# Altium project BrushlessDriver.PrjPCB
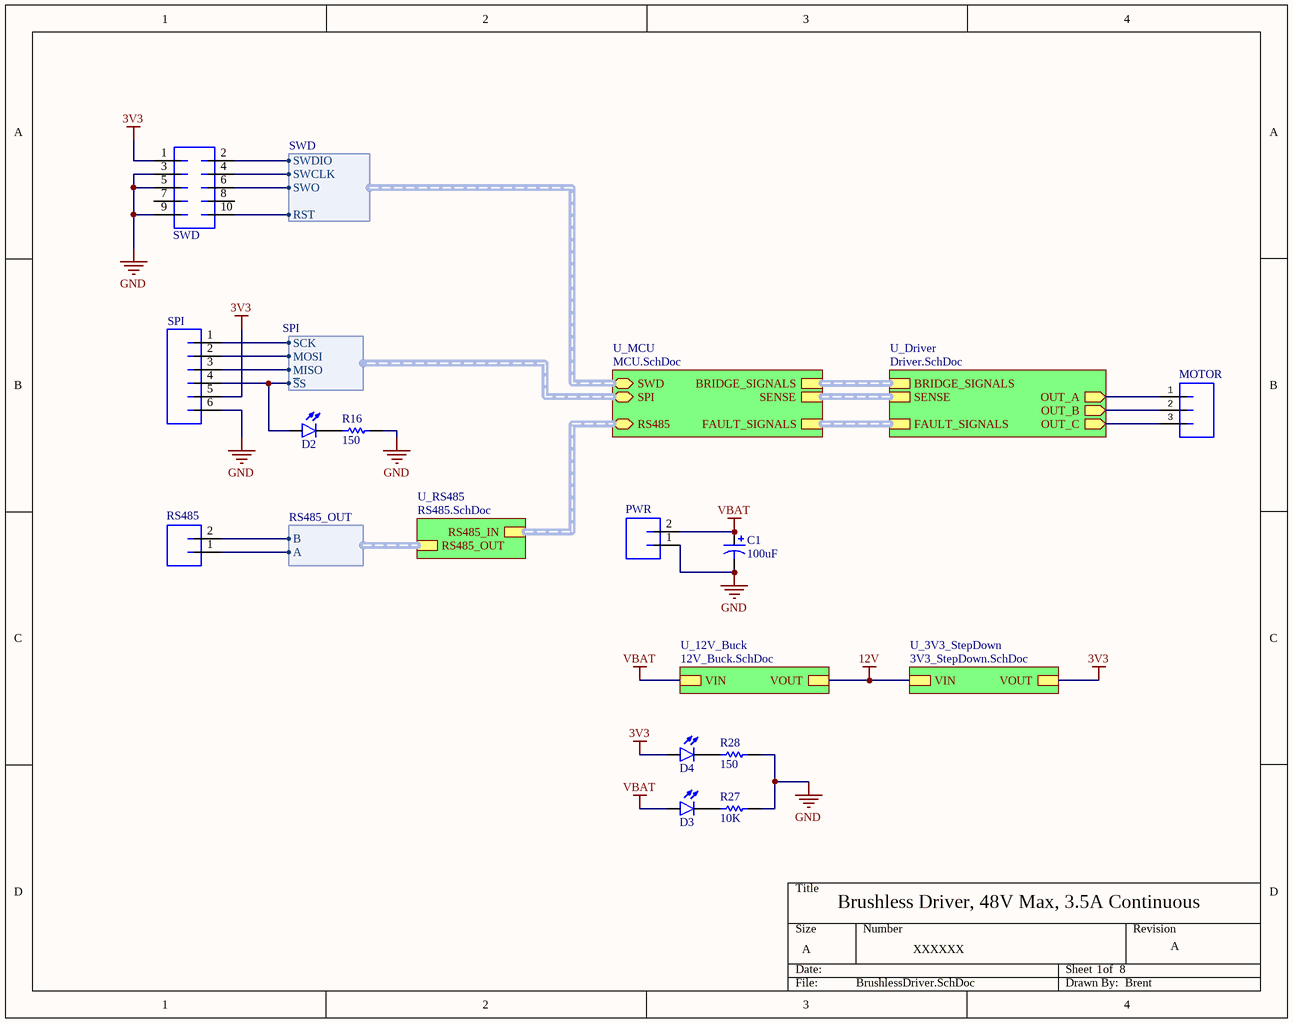
[diagram p0: BrushlessDriver.SchDoc]
8 sheets, 77 parts. Net scope: hierarchical (ports join the sheet entries above them; power ports are global).
Board file: BrushlessDriver.PcbDoc
Sheets:
  BrushlessDriver.SchDoc
    U_12V_Buck = 12V_Buck.SchDoc
    U_Driver = Driver.SchDoc
      A = CurrentSenseLowSide.SchDoc
      C = CurrentSenseLowSide.SchDoc
      U_CurrentSenseAmpBias = CurrentSenseAmpBias.SchDoc
    U_MCU = MCU.SchDoc
    U_RS485 = RS485.SchDoc
    U_3V3_StepDown = 3V3_StepDown.SchDoc

## Sheet BrushlessDriver.SchDoc: Brushless Driver, 48V Max, 3.5A Continuous
size A; DrawnBy: Brent; DocumentNumber: XXXXXX; Revision: A; SheetNumber: 1; SheetTotal: 8

### Parts
C1  value 100uF  [CAP-ELECTROLYTIC[10.0x12.6]]  (hidden comment: 100uF 63V)
D2  LED_0603_GREEN_5mA  [LED0603]  (value not drawn)
D3  LED_0603_ORANGE_5mA  [LED0603]  (value not drawn)
D4  LED_0603_GREEN_5mA  [LED0603]  (value not drawn)
MOTOR  MotorConnector  [MotorConnector]  (value not drawn)
PWR  MOLEX_MICROFIT_2_SMD_HORZ  [MOLEX-MICROFIT-2-SMD-HORZ]  (value not drawn)
R16  150  [RESC0603(1608)_L]
R27  10K  [RESC0603(1608)_N]
R28  150  [RESC0603(1608)_L]
RS485  JST_PH_2_VERT  [JST-PH-2-PTH-VERT]  (value not drawn)
SPI  JST_PH_6_VERT  [JST-PH-6-PTH-VERT]  (value not drawn)
SWD  1.27mm SWD Connector  [SWD-SMD]  (value not drawn)

### Sub-sheets
U_3V3_StepDown = 3V3_StepDown.SchDoc: VIN, VOUT
U_12V_Buck = 12V_Buck.SchDoc: VIN, VOUT
U_Driver = Driver.SchDoc: OUT_A (out), OUT_B (out), OUT_C (out), BRIDGE_SIGNALS (harness BRIDGE_SIG), SENSE (harness PHASE_SENSE), FAULT_SIGNALS (harness FAULT_SIG)
U_MCU = MCU.SchDoc: BRIDGE_SIGNALS (harness BRIDGE_SIG), FAULT_SIGNALS (harness FAULT_SIG), SENSE (harness PHASE_SENSE), SWD (harness SWD), SPI (harness SPI), RS485 (harness RS485_IN)
U_RS485 = RS485.SchDoc: RS485_IN (harness RS485_IN), RS485_OUT (harness RS485_OUT)

### Harnesses
SPI: SCK, MOSI, MISO, ~{S}S
RS485_OUT: A, B
SWD: SWCLK, SWDIO, RST, SWO

### Nets
3V3: D4.A SPI.5 SWD.1 ; sheet U_3V3_StepDown/VOUT
12V: sheet U_12V_Buck/VOUT, sheet U_3V3_StepDown/VIN
GND: C1.2 PWR.1 R16.1 R27.2 R28.1 SPI.6 SWD.3 SWD.5 SWD.9
VBAT: C1.1 D3.A PWR.2 ; sheet U_12V_Buck/VIN
NRST: SWD.10 ; sheet U_MCU/SWD.RST
OUT_A: MOTOR.1 ; sheet U_Driver/OUT_A
OUT_B: MOTOR.2 ; sheet U_Driver/OUT_B
OUT_C: MOTOR.3 ; sheet U_Driver/OUT_C
RS485_A: RS485.1 ; sheet U_RS485/RS485_OUT.A
RS485_B: RS485.2 ; sheet U_RS485/RS485_OUT.B
SPI1_MISO: SPI.3 ; sheet U_MCU/SPI.MISO
SPI1_MOSI: SPI.2 ; sheet U_MCU/SPI.MOSI
SPI1_NSS/PA15: D2.A SPI.4 ; sheet U_MCU/SPI.~{S}S
SPI1_SCK: SPI.1 ; sheet U_MCU/SPI.SCK
SWCLK: SWD.4 ; sheet U_MCU/SWD.SWCLK
SWDIO: SWD.2 ; sheet U_MCU/SWD.SWDIO
SWO: SWD.6 ; sheet U_MCU/SWD.SWO
NetD2_C: D2.C R16.2
NetD3_C: D3.C R27.1
NetD4_C: D4.C R28.2

Not connected (* = marked no-connect by the designer): SWD 7 8

### Buses and harness runs
harness sheet U_Driver/BRIDGE_SIGNALS = sheet U_MCU/BRIDGE_SIGNALS
harness sheet U_Driver/FAULT_SIGNALS = sheet U_MCU/FAULT_SIGNALS
harness sheet U_Driver/SENSE = sheet U_MCU/SENSE
harness sheet U_MCU/RS485 = sheet U_RS485/RS485_IN

### Library data of the parts
C1 = CAP_100uF_63V_20%: 100uF 63V 20%; PartNumber: PCR1J101MCL1GS; Manufacturer: Nichicon; Mounting Technology: Surface Mount; PackageReference: 1H; PackageDescription: 10x12.7mm; Voltage: 63V; Tolerance: 20%
D2 D4 = LED_0603_GREEN_5mA: PartNumber: LTST-C193TGKT-5A; Manufacturer: Lite-On Inc.; PackageReference: 0603; PackageDescription: 0603 (1608 Metric); Mounting Technology: Surface Mount
D3 = LED_0603_ORANGE_5mA: PartNumber: LTST-C193KFKT-5A; Manufacturer: Lite-On Inc.; PackageReference: 0603; PackageDescription: 0603 (1608 Metric); Mounting Technology: Surface Mount
PWR = MOLEX_MICROFIT_2_SMD_HORZ: Manufacturer: Molex; PartNumber: 43650-0212; Mounting Technology: Surface Mount; PackageReference: Microfit-3.0mm
R16 R28 = CMP-1012-00415-1: 150R 0.1W 1% 0603 (1608 Metric)  SMD; Case-Metric: 1608; Value: 150.00 Ohm; Case-EIA: 0603; Tolerance: 1 %; Power: 0.1 W; Technology: SMT
R27 = CMP-1012-00623-1: 10K 0.1W 1% 0603 (1608 Metric)  SMD; Value: 10000.00 Ohm; Case-EIA: 0603; Case-Metric: 1608; Power: 0.1 W; Tolerance: 1 %; Technology: SMT
RS485 = JST_PH_2_VERT: Manufacturer: JST Sales America, Inc.; PartNumber: B2B-PH-K-S(LF)(SN); Mounting Technology: Through Hole; PackageReference: JST-PH
SPI = JST_PH_6_VERT: PartNumber: B6B-PH-K-S(LF)(SN); Manufacturer: JST Sales America Inc.; PackageReference: JST-PH; Mounting Technology: Through Hole
SWD = SWD: Manufacturer: Samtec; PartNumber: FTSH-105-01-F-DV; Mounting Technology: SMD; PackageReference: Header-1.27mm-2x5

## Sheet 12V_Buck.SchDoc: 12.1V Buck Converter
size A; DrawnBy: Brent; DocumentNumber: XXXXXX; Revision: A; SheetNumber: 7; SheetTotal: 8
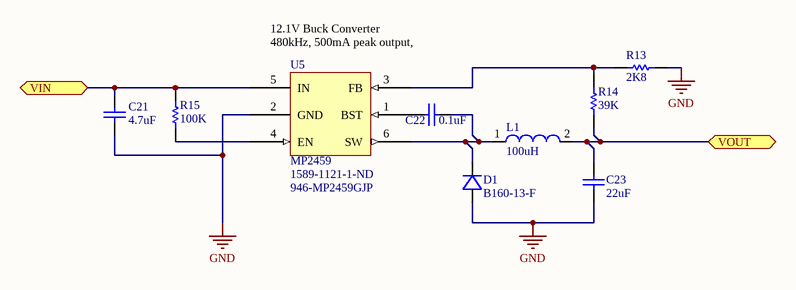
[diagram p1: 12V_Buck.SchDoc]

### Parts
C21  4.7uF  [CAPC1210(3225)280_L]
C22  0.1uF  [CAPC0603(1608)100_L]
C23  22uF  [CAPC1210(3225)210_L]
D1  B160-13-F  [DO-214AC]
L1  100uH  [WE-PD-XS-PB]
R13  2K8  [RESC0603(1608)_L]
R14  39K  [RESC0603(1608)_L]
R15  100K  [RESC0603(1608)_N]
U5  MP2459  Supplier Part Number 1: 1589-1121-1-ND  Supplier Part Number 2: 946-MP2459GJP  [TSOT23-6]

### Ports
VIN, VOUT

### Nets
12V: C23.2 L1.2 R14.2 ; port VOUT
GND: C21.1 C23.1 D1.2(A) R13.1 U5.2(GND)
VBAT: C21.2 R15.2 U5.5(IN) ; port VIN
NetC22_1: C22.1 U5.1(BST)
NetC22_2: C22.2 D1.1(K) L1.1 U5.6(SW)
NetR13_2: R13.2 R14.1 U5.3(FB)
NetR15_1: R15.1 U5.4(EN)

### Notes on the sheet
- (near U5) 12.1V Buck Converter
  480kHz, 500mA peak output, 4.5V-55V input

### Library data of the parts
C21 = CMP-1038-02163-1: CAP 4.7uF 50V ±20% 1210 (3225 Metric) Thickness 2.8mm SMD; Case-EIA: 1210; Case-Metric: 3225; Tolerance: Â±20%; Max Thickness: 2.8 mm; Rated Voltage: 50 V; Technology: SMT; Value: 4.7uF
C22 = CMP-1035-02595-1: CAP 100nF 100V ±10% 0603 (1608 Metric) Thickness 1mm SMD; Tolerance: Â±10%; Case-EIA: 0603; Case-Metric: 1608; Rated Voltage: 100 V; Value: 100nF; Technology: SMT; Max Thickness: 1 mm
C23 = CMP-1038-02278-1: CAP 22uF 16V ±20% 1210 (3225 Metric) Thickness 2.05mm SMD; Case-Metric: 3225; Case-EIA: 1210; Tolerance: Â±20%; Rated Voltage: 16 V; Value: 22uF; Technology: SMT; Max Thickness: 2.05 mm
L1 = CMP-0227-00265-1: SMD-Shielded Power Inductor WE-PD, L = 100 µH; Inductance: 100 ÂµH; ComponentLink1Description: Manufacturer Link; PackageDescription: SMD Inductor, 2-Leads, Body 5.9 x 6.2 mm; ComponentLink1URL: http://www.we-online.com; ComponentLink2URL: http://www.we-online.de/katalog/media/pdf/744778520.pdf; ComponentLink2Description: Datasheet; PackageVersion: 2004; DatasheetVersion: ver 2, Oct-2004; PackageReference: WE-PD-XS-PB
R13 = CMP-1012-00559-1: 2K8 0.1W 1% 0603 (1608 Metric)  SMD; Case-EIA: 0603; Case-Metric: 1608; Value: 2800.00 Ohm; Tolerance: 1 %; Technology: SMT; Power: 0.1 W
R14 = CMP-1012-00689-1: 39K 0.1W 1% 0603 (1608 Metric)  SMD; Case-Metric: 1608; Case-EIA: 0603; Value: 39000.00 Ohm; Technology: SMT; Tolerance: 1 %; Power: 0.1 W
R15 = CMP-1012-00736-1: 100K 0.1W 1% 0603 (1608 Metric)  SMD; Value: 100000.00 Ohm; Case-Metric: 1608; Case-EIA: 0603; Power: 0.1 W; Tolerance: 1 %; Technology: SMT
D1 = B160-13-F: Supplier 1: Digikey
U5 = MP2459: Supplier 1: Digikey; Supplier 2: Mouser

## Sheet Driver.SchDoc: Driver
size A; DrawnBy: Brent; DocumentNumber: XXXXXX; Revision: A; SheetNumber: 3; SheetTotal: 8
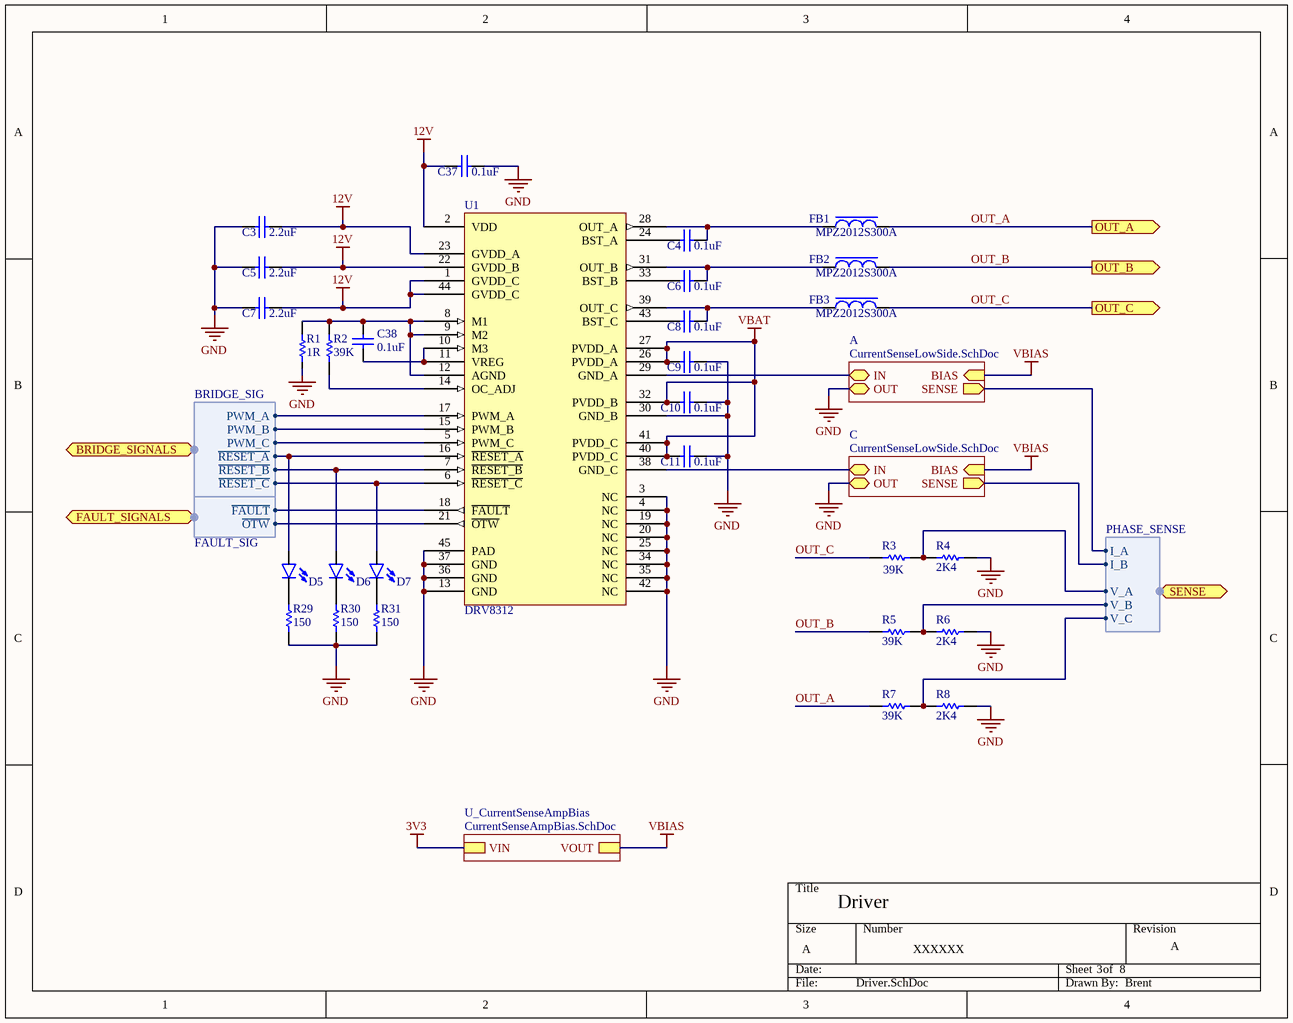
[diagram p2: Driver.SchDoc]

### Parts
C3  2.2uF  [CAPC0603(1608)100_L]
C4  0.1uF  [CAPC0603(1608)100_L]
C5  2.2uF  [CAPC0603(1608)100_L]
C6  0.1uF  [CAPC0603(1608)100_L]
C7  2.2uF  [CAPC0603(1608)100_L]
C8  0.1uF  [CAPC0603(1608)100_L]
C9  0.1uF  [CAPC0603(1608)100_L]
C10  0.1uF  [CAPC0603(1608)100_L]
C11  0.1uF  [CAPC0603(1608)100_L]
C37  0.1uF  [CAPC0603(1608)100_L]
C38  0.1uF  [CAPC0603(1608)100_L]
D5  LED_0603_BLUE_5mA  [LED0603]  (value not drawn)
D6  LED_0603_BLUE_5mA  [LED0603]  (value not drawn)
D7  LED_0603_BLUE_5mA  [LED0603]  (value not drawn)
FB1  MPZ2012S300A  [0805-Ferrite]
FB2  MPZ2012S300A  [0805-Ferrite]
FB3  MPZ2012S300A  [0805-Ferrite]
R1  1R  [RESC0603(1608)_L]
R2  39K  [RESC0603(1608)_L]
R3  39K  [RESC0603(1608)_L]
R4  2K4  [RESC0603(1608)_L]
R5  39K  [RESC0603(1608)_L]
R6  2K4  [RESC0603(1608)_L]
R7  39K  [RESC0603(1608)_L]
R8  2K4  [RESC0603(1608)_L]
R29  150  [RESC0603(1608)_L]
R30  150  [RESC0603(1608)_L]
R31  150  [RESC0603(1608)_L]
U1  DRV8312  [HTSSOP-44E]

### Sub-sheets
A = CurrentSenseLowSide.SchDoc: SENSE (out), BIAS (in), IN, OUT
C = CurrentSenseLowSide.SchDoc: SENSE (out), BIAS (in), IN, OUT
U_CurrentSenseAmpBias = CurrentSenseAmpBias.SchDoc: VIN, VOUT

### Ports
BRIDGE_SIGNALS (harness BRIDGE_SIG), FAULT_SIGNALS (harness FAULT_SIG), OUT_A (out), OUT_B (out), OUT_C (out), SENSE (harness PHASE_SENSE)

### Harnesses
BRIDGE_SIG: PWM_A, PWM_B, PWM_C, ~{RESET_A}, ~{RESET_B}, ~{RESET_C}
PHASE_SENSE: V_C, V_B, V_A, I_B, I_A
FAULT_SIG: ~{FAULT}, ~{OTW}

### Nets
12V: C3.1 C5.1 C7.1 C37.1 U1.1(GVDD_C) U1.2(VDD) U1.22(GVDD_B) U1.23(GVDD_A) U1.44(GVDD_C)
GND: C3.2 C5.2 C7.2 C9.2 C10.2 C11.2 C37.2 R1.2 R4.1 R6.1 R8.1 R29.1 R30.1 R31.1 U1.3(NC) U1.4(NC) U1.13(GND) U1.19(NC) U1.20(NC) U1.25(NC) U1.30(GND_B) U1.34(NC) U1.35(NC) U1.36(GND) U1.37(GND) U1.42(NC) U1.45(PAD) ; sheet A/OUT, sheet C/OUT
VBAT: C9.1 C10.1 C11.1 U1.26(PVDD_A) U1.27(PVDD_A) U1.32(PVDD_B) U1.40(PVDD_C) U1.41(PVDD_C)
VBIAS: sheet A/BIAS, sheet C/BIAS, sheet U_CurrentSenseAmpBias/VOUT
ADC1_IN1: sheet C/SENSE, port SENSE.I_B
ADC1_IN2: sheet A/SENSE, port SENSE.I_A
ADC1_IN3: R5.1 R6.2 ; port SENSE.V_B
ADC1_IN4: R7.1 R8.2 ; port SENSE.V_C
ADC2_IN1: R3.1 R4.2 ; port SENSE.V_A
OUT_A: FB1.2 R7.2 ; port OUT_A
OUT_B: FB2.2 R5.2 ; port OUT_B
OUT_C: FB3.2 R3.2 ; port OUT_C
PA11: U1.21(~{OTW}) ; port FAULT_SIGNALS.~{OTW}
PB0: D7.A U1.6(~{RESET_C}) ; port BRIDGE_SIGNALS.~{RESET_C}
PB1: D6.A U1.7(~{RESET_B}) ; port BRIDGE_SIGNALS.~{RESET_B}
PB4: D5.A U1.16(~{RESET_A}) ; port BRIDGE_SIGNALS.~{RESET_A}
PB5: U1.18(~{FAULT}) ; port FAULT_SIGNALS.~{FAULT}
TIM1_CH1: U1.5(PWM_C) ; port BRIDGE_SIGNALS.PWM_C
TIM1_CH2: U1.15(PWM_B) ; port BRIDGE_SIGNALS.PWM_B
TIM1_CH3: U1.17(PWM_A) ; port BRIDGE_SIGNALS.PWM_A
NetC4_1: C4.1 U1.24(BST_A)
NetC4_2: C4.2 FB1.1 U1.28(OUT_A)
NetC6_1: C6.1 U1.33(BST_B)
NetC6_2: C6.2 FB2.1 U1.31(OUT_B)
NetC8_1: C8.1 U1.43(BST_C)
NetC8_2: C8.2 FB3.1 U1.39(OUT_C)
NetC38_1: C38.1 U1.10(M3) U1.11(VREG)
NetC38_2: C38.2 R1.1 R2.2 U1.8(M1) U1.9(M2) U1.12(AGND)
NetD5_C: D5.C R29.2
NetD6_C: D6.C R30.2
NetD7_C: D7.C R31.2
NetR2_1: R2.1 U1.14(OC_ADJ)
NetR12_A_2: U1.29(GND_A) ; sheet A/IN
NetR12_C_2: U1.38(GND_C) ; sheet C/IN

### Library data of the parts
C3 C5 C7 = CMP-1035-02767-1: CAP 2.2uF 25V ±10% 0603 (1608 Metric) Thickness 1mm SMD; Case-EIA: 0603; Tolerance: Â±10%; Case-Metric: 1608; Technology: SMT; Value: 2.2uF; Max Thickness: 1 mm; Rated Voltage: 25 V
C4 C6 C8-C11 C37 C38 = CMP-1035-02595-1: as C22 on sheet 12V_Buck; Rated Voltage: 100 V; Value: 100nF; Technology: SMT; Max Thickness: 1 mm
D5-D7 = LED_0603_BLUE_5mA: PartNumber: LTST-C193TBKT-5A; Manufacturer: Lite-On Inc.; PackageReference: 0603; PackageDescription: 0603 (1608 Metric); Mounting Technology: Surface Mount
R1 = CMP-1012-00002-1: 1R 0.1W 5% 0603 (1608 Metric)  SMD; Value: 1.00 Ohm; Case-Metric: 1608; Case-EIA: 0603; Power: 0.1 W; Technology: SMT; Tolerance: 5 %
R2 R3 R5 R7 = CMP-1012-00689-1: as R14 on sheet 12V_Buck; Technology: SMT; Tolerance: 1 %; Power: 0.1 W
R4 R6 R8 = CMP-1012-00551-1: 2K4 0.1W 1% 0603 (1608 Metric)  SMD; Case-EIA: 0603; Case-Metric: 1608; Value: 2400.00 Ohm; Technology: SMT; Tolerance: 1 %; Power: 0.1 W
R29-R31 = CMP-1012-00415-1: as R16 on sheet BrushlessDriver; Tolerance: 1 %; Power: 0.1 W; Technology: SMT

## Sheet CurrentSenseLowSide.SchDoc: Low-Side Phase Current Sense
size A; DrawnBy: Brent; DocumentNumber: XXXXXX; Revision: A; SheetNumber: 4; SheetTotal: 8
Used 2 times, as channels U_Driver/A, U_Driver/C. Parts and nets are listed once, with the designators drawn on the sheet.
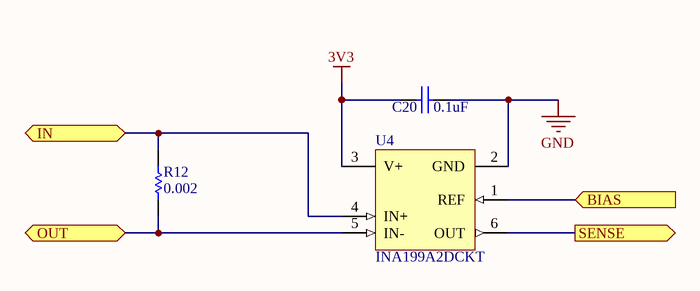
[diagram p3: CurrentSenseLowSide.SchDoc]

### Parts
C20  0.1uF  [CAPC0603(1608)100_L]
R12  0.002  [0805-SHUNT]
U4  INA199A2DCKT  [DCK0006A_L]

### Ports
BIAS (in), IN, OUT, SENSE (out)

### Nets
3V3: C20.1 U4.3(V+)
GND: C20.2 U4.2(GND)
BIAS: U4.1(REF) ; port BIAS
IN: R12.2 U4.4(IN+) ; port IN
OUT: R12.1 U4.5(IN-) ; port OUT
SENSE: U4.6(OUT) ; port SENSE

### Channels
U_Driver/A: designators end in _A; ports BIAS=VBIAS IN=NetR12_A_2 OUT=GND SENSE=ADC1_IN2
U_Driver/C: designators end in _C; ports BIAS=VBIAS IN=NetR12_C_2 OUT=GND SENSE=ADC1_IN1

### Library data of the parts
C20 = CMP-1035-02595-1: as C22 on sheet 12V_Buck; Rated Voltage: 100 V; Value: 100nF; Technology: SMT; Max Thickness: 1 mm
R12 = PMR10EZPFV2L00
U4 = CMP-0704-00045-2: Voltage Output, High or Low Side Measurement, Bi-Directional Zero-Drift Series, 2.7 to 26 V, -40 to 125 degC, 6-pin SOT23 (DCK6), Green (RoHS & no Sb/Br); Vs(Min)(V): 2.7; SubFamily: Current Shunt Monitor; Gain(V/V): 100; Quiescent Current (+/-)(Typ)(mA): 0.065; Vs(Max)(V): 26; Rating: Catalog; Input Offset (+/-)(Max)(uV): 150; Input Offset Drift (+/-)(Max)(uV/Degrees Celsius): 0.5; Small-Signal Bandwidth(Typ)(MHz): 0.03; Common Mode Range(Min)(V): -0.3; PackageReference: DCK0006A; PackageVersion: 4093553-4/G, 01/2007; Mounting Technology: Surface Mount; ComponentLink3URL: http://www.ti.com/lit/ds/symlink/ina212-q1.pdf; ComponentLink3Description: Package Specification; Common Mode Range(Max)(V): 26; Code_JEDEC: MO-203; Output Type: Voltage; CMRR(Min)(dB): 100; ComponentLink2Description: Datasheet; ComponentLink2URL: http://www.ti.com/general/docs/lit/getliterature.tsp?genericPartNumber=INA199A2&fileType=pdf; ComponentLink1Description: Manufacturer URL; ComponentLink1URL: http://www.ti.com/; Eco-Plan: Green (RoHS & no Sb/Br); PackageDescription: 6-Pin Plastic Small Outline, Body 2 x 1.25 mm, Pitch 0.65 mm; DatasheetVersion: SBOS469D; PartNumber: INA199A2DCKT

## Sheet CurrentSenseAmpBias.SchDoc: Current Sense Amplifier Bias Voltage
size A; DrawnBy: Brent; DocumentNumber: XXXXXX; Revision: A; SheetNumber: 5; SheetTotal: 8
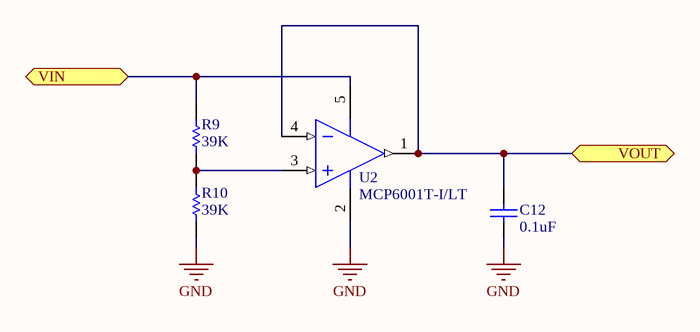
[diagram p4: CurrentSenseAmpBias.SchDoc]

### Parts
C12  0.1uF  [CAPC0603(1608)100_L]
R9  39K  [RESC0603(1608)_L]
R10  39K  [RESC0603(1608)_L]
U2  MCP6001T-I/LT  [SC70-LT5_M]

### Ports
VIN, VOUT

### Nets
3V3: R9.2 U2.5(VDD) ; port VIN
GND: C12.1 R10.1 U2.2(VSS)
VBIAS: C12.2 U2.1(VOUT) U2.4(VIN-) ; port VOUT
NetR9_1: R9.1 R10.2 U2.3(VIN+)

### Library data of the parts
C12 = CMP-1035-02595-1: as C22 on sheet 12V_Buck; Rated Voltage: 100 V; Value: 100nF; Technology: SMT; Max Thickness: 1 mm
R9 R10 = CMP-1012-00689-1: as R14 on sheet 12V_Buck; Technology: SMT; Tolerance: 1 %; Power: 0.1 W
U2 = CMP-0187-00457-2: 1 MHz, Low-Power Operational Amplifier, 5-Pin SC-70, Industrial Temperature, Tape and Reel; RevisionNote: URLs added.; ComponentLink2Description: Datasheet; ComponentLink3URL: http://www.microchip.com/stellent/groups/techpub_sg/documents/packagingspec/en012702.pdf; PackageReference: SC70-LT5; PackageDescription: 5-Lead Plastic Small Outline Transistor (LT) [SC70]; ComponentLink2URL: http://ww1.microchip.com/downloads/en/DeviceDoc/21733j.pdf; ComponentLink3Description: Package Specification; PackageVersion: revBB, Aug-2009; ComponentLink1Description: Manufacturer URL; DatasheetVersion: revJ, Nov-2009; ComponentLink1URL: http://www.microchip.com/; Code_IPC: SOT353-5

## Sheet MCU.SchDoc: STM32F3 Microcontroller
size A; DrawnBy: Brent; DocumentNumber: XXXXXX; Revision: A; SheetNumber: 2; SheetTotal: 8
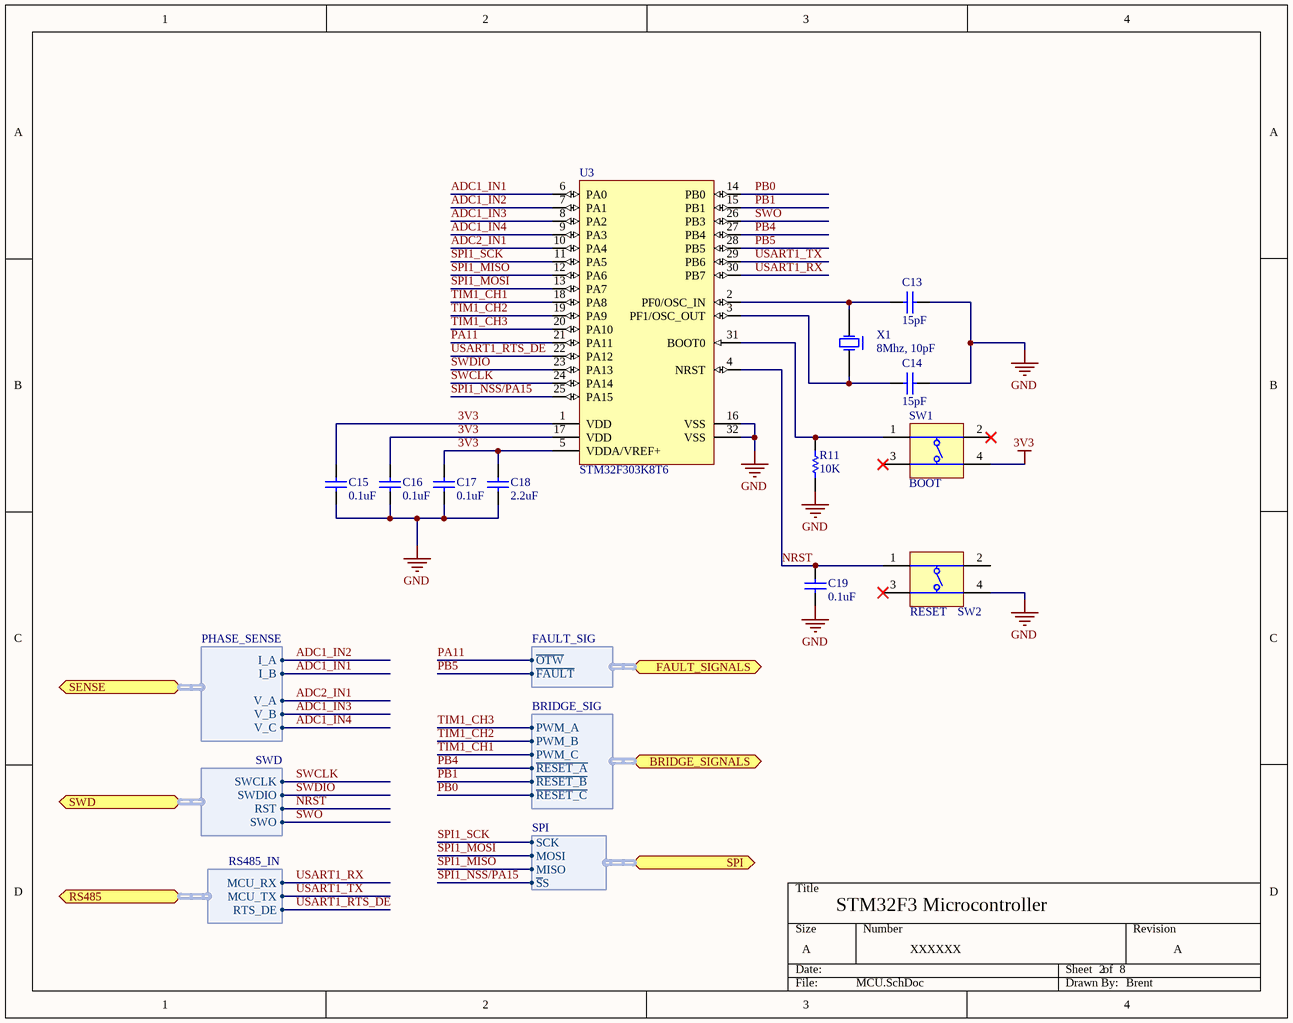
[diagram p5: MCU.SchDoc]

### Parts
C13  15pF  [CAPC0603(1608)100_L]
C14  15pF  [CAPC0603(1608)100_L]
C15  0.1uF  [CAPC0603(1608)100_L]
C16  0.1uF  [CAPC0603(1608)100_L]
C17  0.1uF  [CAPC0603(1608)100_L]
C18  2.2uF  [CAPC0603(1608)100_L]
C19  0.1uF  [CAPC0603(1608)100_L]
R11  10K  [RESC0603(1608)_N]
SW1  BOOT  [SWITCH]
SW2  RESET  [SWITCH]
U3  STM32F303K8T6  [STM-LQFP32_M]
X1  8Mhz, 10pF  [ABRA-ABM3B-4_V]

### Ports
BRIDGE_SIGNALS (harness BRIDGE_SIG), FAULT_SIGNALS (harness FAULT_SIG), RS485 (harness RS485_IN), SENSE (harness PHASE_SENSE), SPI (harness SPI), SWD (harness SWD)

### Harnesses
BRIDGE_SIG: PWM_A, PWM_B, PWM_C, ~{RESET_A}, ~{RESET_B}, ~{RESET_C}
FAULT_SIG: ~{FAULT}, ~{OTW}
PHASE_SENSE: V_C, V_B, V_A, I_B, I_A
SWD: SWCLK, SWDIO, RST, SWO
SPI: SCK, MOSI, MISO, ~{S}S
RS485_IN: MCU_TX, MCU_RX, RTS_DE

### Nets
3V3: C15.2 C16.2 C17.2 C18.1 SW1.4(T3) U3.1(VDD) U3.5(VDDA/VREF+) U3.17(VDD)
GND: C13.2 C14.2 C15.1 C16.1 C17.1 C18.2 C19.1 R11.1 SW2.4(T3) U3.16(VSS) U3.32(VSS)
ADC1_IN1: U3.6(PA0) ; port SENSE.I_B
ADC1_IN2: U3.7(PA1) ; port SENSE.I_A
ADC1_IN3: U3.8(PA2) ; port SENSE.V_B
ADC1_IN4: U3.9(PA3) ; port SENSE.V_C
ADC2_IN1: U3.10(PA4) ; port SENSE.V_A
NRST: C19.2 SW2.1(T1) U3.4(NRST) ; port SWD.RST
PA11: U3.21(PA11) ; port FAULT_SIGNALS.~{OTW}
PB0: U3.14(PB0) ; port BRIDGE_SIGNALS.~{RESET_C}
PB1: U3.15(PB1) ; port BRIDGE_SIGNALS.~{RESET_B}
PB4: U3.27(PB4) ; port BRIDGE_SIGNALS.~{RESET_A}
PB5: U3.28(PB5) ; port FAULT_SIGNALS.~{FAULT}
SPI1_MISO: U3.12(PA6) ; port SPI.MISO
SPI1_MOSI: U3.13(PA7) ; port SPI.MOSI
SPI1_NSS/PA15: U3.25(PA15) ; port SPI.~{S}S
SPI1_SCK: U3.11(PA5) ; port SPI.SCK
SWCLK: U3.24(PA14) ; port SWD.SWCLK
SWDIO: U3.23(PA13) ; port SWD.SWDIO
SWO: U3.26(PB3) ; port SWD.SWO
TIM1_CH1: U3.18(PA8) ; port BRIDGE_SIGNALS.PWM_C
TIM1_CH2: U3.19(PA9) ; port BRIDGE_SIGNALS.PWM_B
TIM1_CH3: U3.20(PA10) ; port BRIDGE_SIGNALS.PWM_A
USART1_RTS_DE: U3.22(PA12) ; port RS485.RTS_DE
USART1_RX: U3.30(PB7) ; port RS485.MCU_RX
USART1_TX: U3.29(PB6) ; port RS485.MCU_TX
NetC13_1: C13.1 U3.2(PF0/OSC_IN) X1.3(X2)
NetC14_1: C14.1 U3.3(PF1/OSC_OUT) X1.1(X1)
NetR11_2: R11.2 SW1.1(T1) U3.31(BOOT0)

Not connected (* = marked no-connect by the designer): SW1 2(T2)* 3(T3)*; SW2 2(T2) 3(T3)*; X1 2

### Library data of the parts
C13 C14 = CMP-1035-00674-1: CAP 15pF 25V ±1% 0603 (1608 Metric) Thickness 1mm SMD; Case-Metric: 1608; Case-EIA: 0603; Tolerance: Â±1%; Max Thickness: 1 mm; Technology: SMT; Value: 15pF; Rated Voltage: 25 V
C15-C17 C19 = CMP-1035-02595-1: as C22 on sheet 12V_Buck; Rated Voltage: 100 V; Value: 100nF; Technology: SMT; Max Thickness: 1 mm
C18 = CMP-1035-02767-1: as C3 on sheet Driver; Technology: SMT; Value: 2.2uF; Max Thickness: 1 mm; Rated Voltage: 25 V
R11 = CMP-1012-00623-1: as R27 on sheet BrushlessDriver; Power: 0.1 W; Tolerance: 1 %; Technology: SMT
SW1 SW2 = DIPT-DTSM-6: Switch, SPNO Push Button SMD; Manufacturer: Diptronics; PartNumber: DTSM-61NT/R; Packing Type: Tape&Reel; Mechanical Life: 200,000 cycles; ComponentLink2URL: http://www.dip.com.tw/Products_tact.htm; ComponentLink1URL: http://www.dip.com.tw/; ComponentLink3URL: http://www.dip.com.tw/PDF/pro_tact/DTSM_G_-6_2_-V.pdf; PackageDescription: Switch, Through-Hole, 4 Leads, Body 8.5x8.5mm, Row Spacing 9.0mm, Pitch 4.5mm; ComponentLink2Description: Datasheet; ComponentLink3Description: Package Specification; ComponentLink1Description: Manufacturer URL; PackageReference: DTSM-6; Mounting Technology: Through Hole
U3 = CMP-0537-00040-1: ARM Cortex-M4 32-bit MCU, 64 KB Flash, 16 KB Internal RAM, 25 I/Os, 32-Pin LQFP, -40 to 85 degC, Tray; Supply Voltage(Vcc) min (V): 2; Internal RAM Size (kB): 16; D/A Converter: 3; FLASH Size (Prog) (kB): 64; I/Os (High Current): 25; Operating Frequency(F) (Processor speed) (MHz): 72; ComponentLink1URL: http://www.st.com/; Package Description: 32-Pin Low Profile Quad Flat Package, 7 x 7 mm Body, 0.8 mm Pitch; Mounting Technology: Surface Mount; ComponentLink2Description: Datasheet; ComponentLink2URL: http://www.st.com/st-web-ui/static/active/en/resource/technical/document/datasheet/DM00092070.pdf; Core: ARM Cortex-M4; ComponentLink1Description: Manufacturer URL; Package Reference: LQFP32; Packing: Tray; DatasheetVersion: Rev. 4
X1 = ABRA-ABM3B-4

## Sheet RS485.SchDoc: RS485
size A; DrawnBy: Brent; DocumentNumber: XXXXXX; Revision: A; SheetNumber: 6; SheetTotal: 8
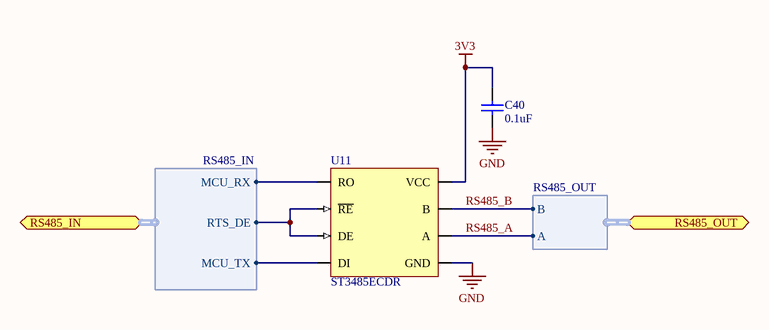
[diagram p6: RS485.SchDoc]

### Parts
C40  0.1uF  [CAPC0603(1608)100_L]
U11  ST3485ECDR  [SOIC-8]

### Ports
RS485_IN (harness RS485_IN), RS485_OUT (harness RS485_OUT)

### Harnesses
RS485_IN: MCU_RX, MCU_TX, RTS_DE
RS485_OUT: A, B

### Nets
3V3: C40.2 U11.8(VCC)
GND: C40.1 U11.5(GND)
RS485_A: U11.6(A) ; port RS485_OUT.A
RS485_B: U11.7(B) ; port RS485_OUT.B
USART1_RTS_DE: U11.2(~{RE}) U11.3(DE) ; port RS485_IN.RTS_DE
USART1_RX: U11.1(RO) ; port RS485_IN.MCU_RX
USART1_TX: U11.4(DI) ; port RS485_IN.MCU_TX

### Library data of the parts
C40 = CMP-1035-02595-1: as C22 on sheet 12V_Buck; Rated Voltage: 100 V; Value: 100nF; Technology: SMT; Max Thickness: 1 mm
U11 = ST3485ECDR: 3.3 V powered, 15 kV ESD protected, up to 12 Mbps RS-485/  RS-422 transceiver 0 to 70; Manufacturer: STMicroelectronics; Mounting Technology: Surface Mount; PackageReference: SOIC-8; PackageDescription: SOIC-8; PartNumber: ST3485ECDR

## Sheet 3V3_StepDown.SchDoc: 3V3 Step Down
size A; DrawnBy: Brent; DocumentNumber: XXXXXX; Revision: A; SheetNumber: 8; SheetTotal: 8
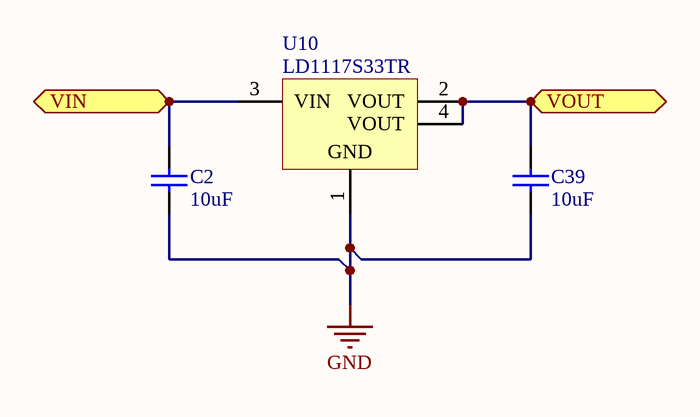
[diagram p7: 3V3_StepDown.SchDoc]

### Parts
C2  10uF  [CAPC0603(1608)100_L]
C39  10uF  [CAPC0603(1608)100_L]
U10  LD1117S33TR  [SOT-223_L]

### Ports
VIN, VOUT

### Nets
3V3: C39.2 U10.2(VOUT) U10.4(VOUT) ; port VOUT
12V: C2.2 U10.3(VIN) ; port VIN
GND: C2.1 C39.1 U10.1(GND)

### Library data of the parts
C2 C39 = CMP-1035-02797-1: CAP 10uF 6.3V ±20% 0603 (1608 Metric) Thickness 1mm SMD; Case-Metric: 1608; Case-EIA: 0603; Tolerance: Â±20%; Value: 10uF; Technology: SMT; Max Thickness: 1 mm; Rated Voltage: 6.3 V
U10 = CMP-0244-00310-1: Fixed Low Drop Positive Voltage Regulator, 3.3V, 4-Pin SOT-223, Tape and Reel; ComponentLink2Description: Datasheet; PackageDescription: 4-Pin SOT-223 Package, 6.5 x 3.5 mm Body, 2.3 mm Pitch, 7 mm Lead Span; PackageVersion: 2010; ComponentLink2URL: http://www.st.com/internet/com/TECHNICAL_RESOURCES/TECHNICAL_LITERATURE/DATASHEET/CD00000544.pdf; PackageReference: SOT-223; DatasheetVersion: 1/11/2011; ComponentLink1Description: Manufacturer URL; ComponentLink1URL: http://www.st.com

## Nets that join several sheets
3V3: BrushlessDriver (D4.A SPI.5 SWD.1), U_Driver/A (C20_A.1 U4_A.3), U_Driver/C (C20_C.1 U4_C.3), CurrentSenseAmpBias (R9.2 U2.5), MCU (8 pins), RS485 (C40.2 U11.8), 3V3_StepDown (C39.2 U10.2 U10.4)
12V: 12V_Buck (C23.2 L1.2 R14.2), Driver (9 pins), 3V3_StepDown (C2.2 U10.3)
GND: BrushlessDriver (9 pins), 12V_Buck (5 pins), Driver (27 pins), U_Driver/A (C20_A.2 R12_A.1 U4_A.2 U4_A.5), U_Driver/C (C20_C.2 R12_C.1 U4_C.2 U4_C.5), CurrentSenseAmpBias (C12.1 R10.1 U2.2), MCU (11 pins), RS485 (C40.1 U11.5), 3V3_StepDown (C2.1 C39.1 U10.1)
VBAT: BrushlessDriver (C1.1 D3.A PWR.2), 12V_Buck (C21.2 R15.2 U5.5), Driver (8 pins)
VBIAS: U_Driver/A (U4_A.1), U_Driver/C (U4_C.1), CurrentSenseAmpBias (C12.2 U2.1 U2.4)
ADC1_IN1: U_Driver/C (U4_C.6), MCU (U3.6)
ADC1_IN2: U_Driver/A (U4_A.6), MCU (U3.7)
ADC1_IN3: Driver (R5.1 R6.2), MCU (U3.8)
ADC1_IN4: Driver (R7.1 R8.2), MCU (U3.9)
ADC2_IN1: Driver (R3.1 R4.2), MCU (U3.10)
NetR12_A_2: Driver (U1.29), U_Driver/A (R12_A.2 U4_A.4)
NetR12_C_2: Driver (U1.38), U_Driver/C (R12_C.2 U4_C.4)
NRST: BrushlessDriver (SWD.10), MCU (C19.2 SW2.1 U3.4)
OUT_A: BrushlessDriver (MOTOR.1), Driver (FB1.2 R7.2)
OUT_B: BrushlessDriver (MOTOR.2), Driver (FB2.2 R5.2)
OUT_C: BrushlessDriver (MOTOR.3), Driver (FB3.2 R3.2)
PA11: Driver (U1.21), MCU (U3.21)
PB0: Driver (D7.A U1.6), MCU (U3.14)
PB1: Driver (D6.A U1.7), MCU (U3.15)
PB4: Driver (D5.A U1.16), MCU (U3.27)
PB5: Driver (U1.18), MCU (U3.28)
RS485_A: BrushlessDriver (RS485.1), RS485 (U11.6)
RS485_B: BrushlessDriver (RS485.2), RS485 (U11.7)
SPI1_MISO: BrushlessDriver (SPI.3), MCU (U3.12)
SPI1_MOSI: BrushlessDriver (SPI.2), MCU (U3.13)
SPI1_NSS/PA15: BrushlessDriver (D2.A SPI.4), MCU (U3.25)
SPI1_SCK: BrushlessDriver (SPI.1), MCU (U3.11)
SWCLK: BrushlessDriver (SWD.4), MCU (U3.24)
SWDIO: BrushlessDriver (SWD.2), MCU (U3.23)
SWO: BrushlessDriver (SWD.6), MCU (U3.26)
TIM1_CH1: Driver (U1.5), MCU (U3.18)
TIM1_CH2: Driver (U1.15), MCU (U3.19)
TIM1_CH3: Driver (U1.17), MCU (U3.20)
USART1_RTS_DE: MCU (U3.22), RS485 (U11.2 U11.3)
USART1_RX: MCU (U3.30), RS485 (U11.1)
USART1_TX: MCU (U3.29), RS485 (U11.4)